# EAGLE design Step-to-Talk (EAGLE 8.2.0)
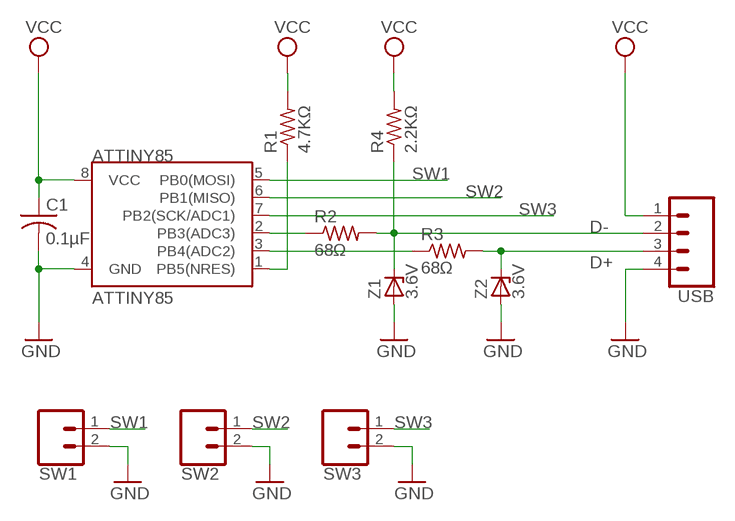
[diagram p0: schematic, sheet 1]

## Parts
ATTINY85  ATTINY85  ATTINY45TINY85-20-DIP  [DIP08_MCU]
C1  0.1µF  C-US025-024X044  [C025-024X044]
R1  4.7KΩ  R-US_0204/5  [0204/5]
R2  68Ω  R-US_0204/5  [0204/5]
R3  68Ω  R-US_0204/5  [0204/5]
R4  2.2KΩ  R-US_0204/5  [0204/5]
SW1  CONN_02  [1X02]
SW2  CONN_02  [1X02]
SW3  CONN_02  [1X02]
USB  CONN_04LONGPADS  [1X04_LONGPADS]
Z1  3.6V  ZENER-DIODEZD-5  [ZDIO-5]
Z2  3.6V  ZENER-DIODEZD-5  [ZDIO-5]

## Nets
D+: R3.2 USB.3 Z2.C
D-: R2.2 R4.1 USB.2 Z1.C
GND: ATTINY85.4(GND) C1.2 SW1.2 SW2.2 SW3.2 USB.4 Z1.A Z2.A
N$1: ATTINY85.1(PB5(NRES)) R1.1
N$2: ATTINY85.3(PB4(ADC2)) R3.1
N$3: ATTINY85.2(PB3(ADC3)) R2.1
SW1: ATTINY85.5(PB0(MOSI)) SW1.1
SW2: ATTINY85.6(PB1(MISO)) SW2.1
SW3: ATTINY85.7(PB2(SCK/ADC1)) SW3.1
VCC: ATTINY85.8(VCC) C1.1 R1.2 R4.2 USB.1

## Library data of the parts
ATTINY85 = SparkFun-Retired:ATTINY45: Atmel 8-pin 2/4/8kB flash uC Retired; PROD_ID: IC-09445; VALUE: TINY85-20-DIP
C1 = adafruit:C-US: CAPACITOR, American symbol
R1-R4 = adafruit:R-US_: RESISTOR, American symbol
SW1-SW3 = SparkFun-Connectors:CONN_02: Multi connection point. Often used as Generic Header-pin footprint for 0.1 inch spaced/style header connections On any of the 0.1 inch spaced packages, you can populate with these: Break Away Headers - Straight <https://www.sparkfun.com/products/116> (PRT-00116) Break Away Male Headers - Right Angle <https://www.sparkfun.com/products/553> (PRT-00553) Female Headers <https://www.sparkfun.com/products/115> (PRT-00115) Break Away Headers - Machine Pin <https://www.sparkfun.com/products/117> (PRT-00117) Break Away Female Headers - Swiss Machine Pin <https://www.sparkfun.com/products/743> (PRT-00743) For SCREWTERMINALS and SPRING TERMINALS visit here: Screw Terimnals on SparkFun.com <https://www.sparkfun.com/search/results?term=Screw+Terminals> (5mm/3.5mm/2.54mm spacing) This device is also useful as a general connection point to wire up your design to another part of your project. Our various solder wires solder well into these plated through hole pads. Hook-Up Wire - Assortment (Stranded, 22 AWG) <https://www.sparkfun.com/products/11375> (PRT-11375) Hook-Up Wire - Assortment (Solid Core, 22 AWG) <https://www.sparkfun.com/products/11367> (PRT-11367) View the entire wire category on our website here <https://www.sparkfun.com/categories/141> Special notes: Molex polarized connector foot print use with: PRT-08233 with associated crimp pins and housings. 2.54_SCREWTERM for use with PRT-10571. 3.5mm Screw Terminal footprints for PRT-08084 5mm Screw Terminal footprints for use with PRT-08432
USB = SparkFun-Connectors:CONN_04: Multi connection point. Often used as Generic Header-pin footprint for 0.1 inch spaced/style header connections On any of the 0.1 inch spaced packages, you can populate with these: Break Away Headers - Straight <https://www.sparkfun.com/products/116> (PRT-00116) Break Away Male Headers - Right Angle <https://www.sparkfun.com/products/553> (PRT-00553) Female Headers <https://www.sparkfun.com/products/115> (PRT-00115) Break Away Headers - Machine Pin <https://www.sparkfun.com/products/117> (PRT-00117) Break Away Female Headers - Swiss Machine Pin <https://www.sparkfun.com/products/743> (PRT-00743) For SCREWTERMINALS and SPRING TERMINALS visit here: Screw Terimnals on SparkFun.com <https://www.sparkfun.com/search/results?term=Screw+Terminals> (5mm/3.5mm/2.54mm spacing) This device is also useful as a general connection point to wire up your design to another part of your project. Our various solder wires solder well into these plated through hole pads. Hook-Up Wire - Assortment (Stranded, 22 AWG) <https://www.sparkfun.com/products/11375> (PRT-11375) Hook-Up Wire - Assortment (Solid Core, 22 AWG) <https://www.sparkfun.com/products/11367> (PRT-11367) View the entire wire category on our website here <https://www.sparkfun.com/categories/141> Special notes: Molex polarized connector foot print use with SKU : PRT-08231 with associated crimp pins and housings. 1MM SMD Version SKU: PRT-10208; PROD_ID: CONN-09696
Z1 Z2 = diode:ZENER-DIODE: Z-Diode

## Board
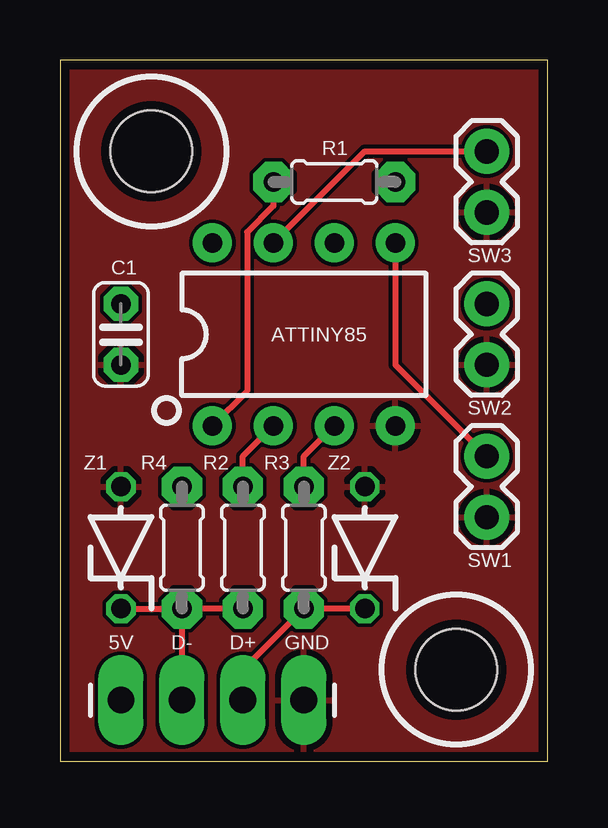
[diagram p1: board, top side]
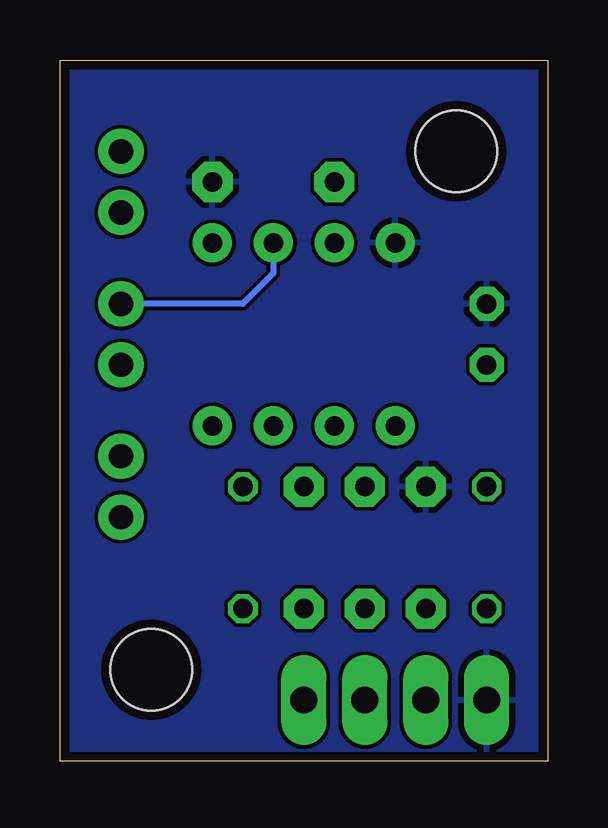
[diagram p2: board, bottom side, seen from below]

Size 20.32 x 29.21 mm. Coordinates in mm from the lower left corner, seen from the top.
Outline: 0,0 20.32,0 20.32,29.21 0,29.2 0,0
Copper layers (1*16): Top 0.0356mm / dielectric 1.5011mm / Bottom 0.0356mm
Design rules "oshpark-2layer": minimum track width 6mil, minimum drill 13mil, track to track 6mil, track to pad 6mil, pad to pad 6mil, via to via 6mil, smd to smd 6mil, copper to edge 15mil, drill to drill 6mil, minimum pad ring 7mil, minimum via ring 7mil, stop-mask expansion 2.5mil, vias tented up to drill 0mil, thermal gap 10mil
Holes 3.4 mm at 3.81,25.4 16.51,3.81

### Footprints (pad centres in the part's own frame; a part is rotated, then mirrored left to right if it is on the bottom)
DIP08_MCU = drill 0.813 pad 1.626: 1 -3.81,-3.81; 2 -1.27,-3.81; 3 1.27,-3.81; 4 3.81,-3.81; 5 3.81,3.81; 6 1.27,3.81; 7 -1.27,3.81; 8 -3.81,3.81
C025-024X044 = drill 0.813 pad 1.422 octagon: 1 -1.27,0; 2 1.27,0
0204/5 = drill 0.813 pad 1.676 octagon: 1 -2.54,0; 2 2.54,0
1X02 = drill 1.016 pad 1.88: 1 0,0; 2 2.54,0
1X04_LONGPADS = drill 1.118 pad 1.88 long: 1 0,0; 2 2.54,0; 3 5.08,0; 4 7.62,0
ZDIO-5 = drill 0.813 octagon: A 2.54,0; C -2.54,0

### Placement (x,y rotation side)
ATTINY85  10.16,17.78 0 top
C1  2.54,17.78 270 top
R1  11.43,24.13 0 top
R2  7.62,8.89 270 top
R3  10.16,8.89 270 top
R4  5.08,8.89 90 top
SW1  17.78,12.7 270 top
SW2  17.78,19.05 270 top
SW3  17.78,25.4 270 top
USB  2.54,2.54 0 top
Z1  2.54,8.89 90 top
Z2  12.7,8.89 90 top

### Tracks (layer width: path | path; a pad name or v marks a point on that pad's centre or on a via)
D+
  Top 0.254: Z2.C R3.2 7.62,3.81 USB.3
D-
  Top 0.254: Z1.C R4.1 | R2.2 R4.1 | R4.1 USB.2
GND
  pour Top: 0,29.21 20.32,29.21 20.32,0 0,0
N$1
  Top 0.254: R1.1 8.89,23.14 7.8,22.04 7.8,15.42 ATTINY85.1
N$2
  Top 0.254: R3.1 10.16,12.7 ATTINY85.3
N$3
  Top 0.254: R2.1 7.62,12.7 ATTINY85.2
SW1
  Top 0.254: ATTINY85.5 13.97,16.51 SW1.1
SW2
  Bottom 0.254: ATTINY85.6 11.43,20.32 12.7,19.05 SW2.1
SW3
  Top 0.254: SW3.1 12.7,25.4 ATTINY85.7
VCC
  pour Bottom: 0,29.21 20.32,29.21 20.32,0 0,0

### Text on the board
tPlace: 5V | D- | D+ | GND
tStop: Step-to-Talk | V1 May 2017